# EAGLE design 4HP_Mixer (EAGLE 7.1.0)
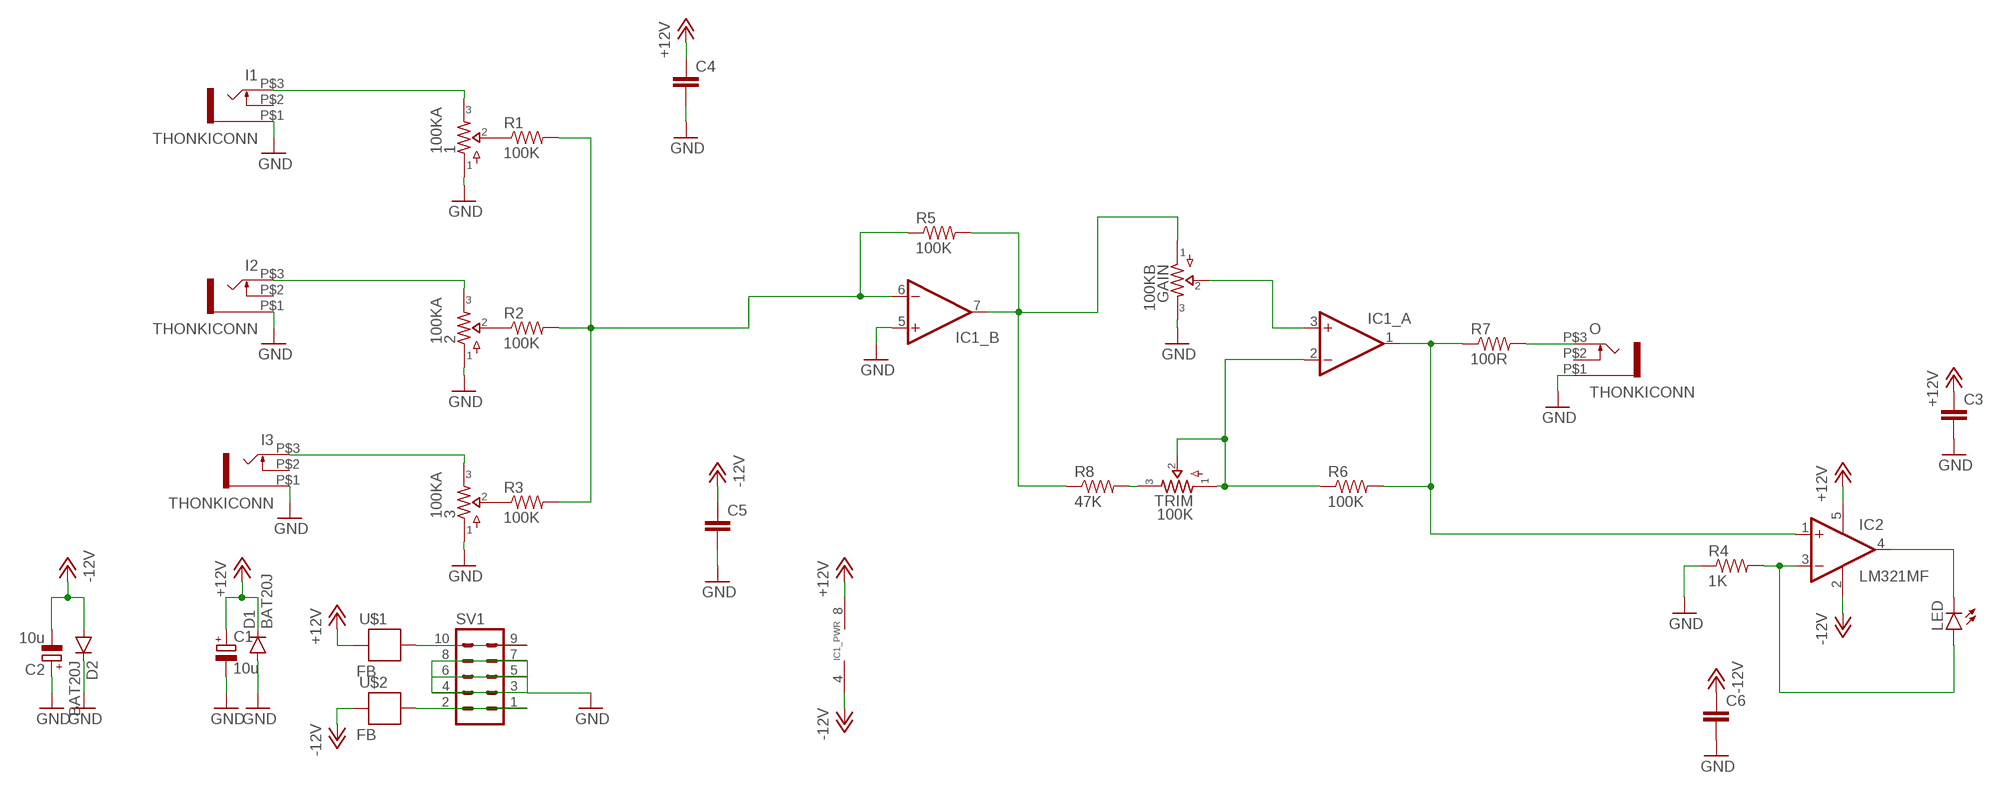
[diagram p0: schematic, sheet 1]

## Parts
1  100KA  POTS9MM_MOUNTED_2MMH  [9MM_W/MOUNTS-2MMHOLES]
2  100KA  POTS9MM_MOUNTED_2MMH  [9MM_W/MOUNTS-2MMHOLES]
3  100KA  POTS9MM_MOUNTED_2MMH  [9MM_W/MOUNTS-2MMHOLES]
C1  10u  CAPACITOR_POL-CASE_B  [CASE_B]
C2  10u  CAPACITOR_POL-CASE_B  [CASE_B]
C3  CAP0603-CAP  [0603-CAP]
C4  CAP0603-CAP  [0603-CAP]
C5  CAP0603-CAP  [0603-CAP]
C6  CAP0603-CAP  [0603-CAP]
D1  BAT20J  DIODESOD123  [SOD-123]
D2  BAT20J  DIODESOD123  [SOD-123]
GAIN  100KB  POTS9MM_MOUNTED_2MMH  [9MM_W/MOUNTS-2MMHOLES]
I1  THONKICONN  [THONKICONN]
I2  THONKICONN  [THONKICONN]
I3  THONKICONN  [THONKICONN]
IC1  DUALSMD  [SO08]
IC2  LM321MF  [SOT23-5]
LED  LED3MM  [LED3MM]
O  THONKICONN  [THONKICONN]
R1  100K  RESISTOR0603-RES  [0603-RES]
R2  100K  RESISTOR0603-RES  [0603-RES]
R3  100K  RESISTOR0603-RES  [0603-RES]
R4  1K  RESISTOR0603-RES  [0603-RES]
R5  100K  RESISTOR0603-RES  [0603-RES]
R6  100K  RESISTOR0603-RES  [0603-RES]
R7  100R  RESISTOR0603-RES  [0603-RES]
R8  47K  RESISTOR0603-RES  [0603-RES]
SV1  EURO_POWER_HEADER  [EURO_POWER_HEADER]
TRIM  100K  POTSSMALL_PADS  [PADS_SMALL]
U$1  FB  [0603]
U$2  FB  [0603]

## Nets
+12V: C1.+ C3.1 C4.1 D1.C IC1.8(_PWR:V+) IC2.5(V+) U$1.2
-12V: C2.- C5.1 C6.1 D2.A IC1.4(_PWR:V-) IC2.2(V-) U$2.2
GND: 1.P$1 2.P$1 3.P$1 C1.- C2.+ C3.2 C4.2 C5.2 C6.2 D1.A D2.C GAIN.P$3 I1.P$1 I2.P$1 I3.P$1 IC1.5(_B:+IN) O.P$1 R4.1 SV1.3 SV1.4 SV1.5 SV1.6 SV1.7 SV1.8
N$1: IC2.3(-IN) LED.A R4.2
N$2: IC2.4(OUT) LED.K(C)
N$3: IC1.2(_A:-IN) R6.1 TRIM.1 TRIM.2
N$4: IC1.1(_A:OUT) IC2.1(+IN) R6.2 R7.1
N$5: GAIN.P$1 IC1.7(_B:OUT) R5.2 R8.1
N$6: O.P$3 R7.2
N$7: 1.P$2 R1.1
N$8: 2.P$2 R2.1
N$9: 3.P$2 R3.1
N$10: IC1.6(_B:-IN) R1.2 R2.2 R3.2 R5.1
N$11: SV1.9 SV1.10 U$1.1
N$12: SV1.1 SV1.2 U$2.1
N$13: GAIN.P$2 IC1.3(_A:+IN)
N$14: R8.2 TRIM.3
N$17: 1.P$3 I1.P$3
N$18: 2.P$3 I2.P$3
N$19: 3.P$3 I3.P$3
Unconnected: I1.P$2 I2.P$2 I3.P$2 O.P$2

## Library data of the parts
1-3 GAIN TRIM = potentiometers:POTS
C1 C2 = dp_devices:CAPACITOR_POL: Polarized capacitor in various packages
C3-C6 = SparkFun-Passives:CAP: Capacitor Standard 0603 ceramic capacitor, and 0.1" leaded capacitor.
D1 D2 = SparkFun-DiscreteSemi:DIODE: Diode These are standard reverse protection diodes and small signal diodes. SMA package can handle up to about 1A. SOD-323 can handle about 200mA. What the SOD-323 package when ordering, there are some mfgs out there that are 5-pin packages.
I1-I3 O = MusicThingModular:THONKICONN
IC1 = integrated circuits:DUAL: OP AMP
IC2 = linear:LM321?*: Low Power Single Op Amp Source: http://cache.national.com/ds/LM/LM321.pdf
LED = SparkFun-LED:LED: LEDs Standard schematic elements and footprints for 5mm, 3mm, 1206, and 0603 sized LEDs. 5mm - Spark Fun Electronics SKU : COM-00529 (and others)
R1-R8 = SparkFun-Passives:RESISTOR: Resistor Basic schematic elements and footprints for 0603, 1206, and PTH resistors.
SV1 = MusicThingModular:EURO_POWER_HEADER: Power Header 10 pin power header for Eurorack Power Supplies
U$1 U$2 = SparkFun-Passives:FB

## Board
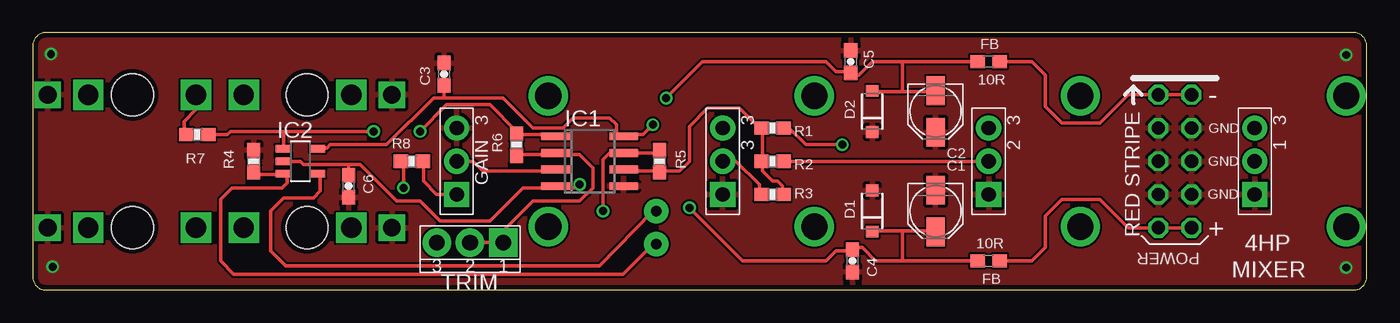
[diagram p1: board, top side]
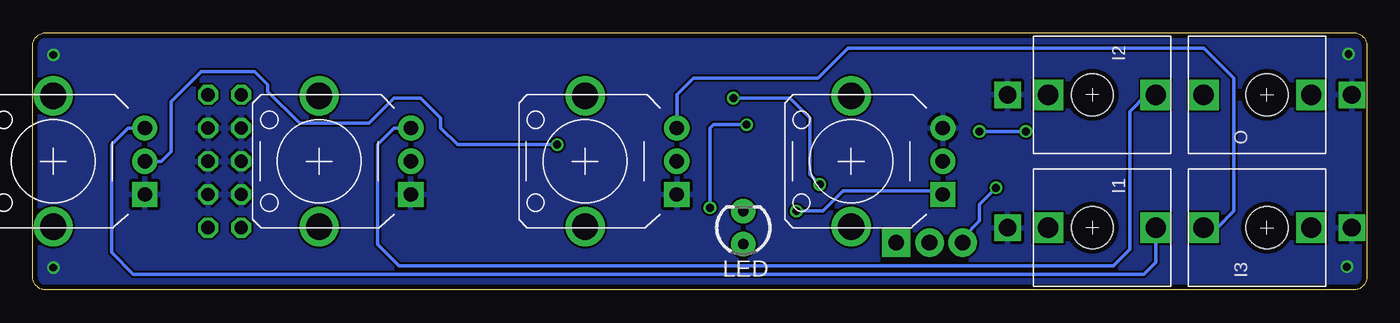
[diagram p2: board, bottom side, seen from below]

Size 101.91 x 19.68 mm. Coordinates in mm from the lower left corner, seen from the top.
Outline: 0,18.67 0,1 arc90 1,0 100.91,0 arc90 101.91,1 101.91,18.67 arc90 100.91,19.67 1,19.67 arc90 0,18.67
Copper layers (1*16): Top 0.0356mm / dielectric 1.5011mm / Bottom 0.0356mm
Design rules "LaenPCBOrder": minimum track width 6mil, minimum drill 13mil, track to track 6mil, track to pad 6mil, pad to pad 6mil, via to via 6mil, smd to smd 6mil, copper to edge 15mil, drill to drill 6mil, minimum pad ring 7mil, minimum via ring 7mil, stop-mask expansion 3mil, vias tented up to drill 0mil, thermal gap 10mil
Holes 3.2 mm at 7.62,14.92 20.95,14.92 20.95,4.76 7.62,4.76

### Footprints (pad centres in the part's own frame; a part is rotated, then mirrored left to right if it is on the bottom)
9MM_W/MOUNTS-2MMHOLES = drill 1.1 pad 1.93 square: P$1 2.54,0 | drill 1.1 pad 1.93: P$2 0,0; P$3 -2.54,0 | drill 2: P$4 -5,7; P$5 5,7
CASE_B = smd 2.2 x 1.4: + 1.6,0; - -1.6,0
0603-CAP = smd 1.1 x 1: 1 -0.85,0; 2 0.85,0
SOD-123 = smd 0.9 x 0.95: A 1.575,0; C -1.575,0
THONKICONN = drill 1.35 square: P$1 0,-6.48 | drill 1.55 square: P$2 0,-3.38; P$3 0,4.84
SO08 = smd 0.6 x 2.2: 1 -1.905,-2.6; 2 -0.635,-2.6; 3 0.635,-2.6; 4 1.905,-2.6; 5 1.905,2.6; 6 0.635,2.6; 7 -0.635,2.6; 8 -1.905,2.6
SOT23-5 = smd 0.6 x 1.2: 1 -0.95,-1.306; 2 0,-1.306; 3 0.95,-1.306; 4 0.95,1.306; 5 -0.95,1.306
LED3MM = drill 0.813 pad 1.88: A -1.27,0; K 1.27,0
0603-RES = smd 1.1 x 1: 1 -0.85,0; 2 0.85,0
EURO_POWER_HEADER = drill 1.016 octagon: 1 -5.08,-1.27; 2 -5.08,1.27; 3 -2.54,-1.27; 4 -2.54,1.27; 5 0,-1.27; 6 0,1.27; 7 2.54,-1.27; 8 2.54,1.27; 9 5.08,-1.27; 10 5.08,1.27
PADS_SMALL = drill 1.2 pad 2.184 square: 1 2.54,0 | drill 1.2 pad 2.184: 2 0,0; 3 -2.54,0
0603 = smd 1.1 x 1: 1 -0.85,0; 2 0.85,0

### Placement (x,y rotation side)
1  93.34,9.84 270 top
2  73.02,9.84 270 top
3  52.71,9.84 270 top
C1  68.96,6.03 270 top
C2  68.96,13.65 270 top
C3  31.43,16.51 90 top
C4  62.61,2.22 270 top
C5  62.48,17.46 90 top
C6  24.13,7.94 270 top
D1  64.13,6.03 90 top
D2  64.13,13.65 90 top
GAIN  32.39,9.84 270 top
I1  20.95,4.76 270 bottom
I2  20.95,14.92 270 bottom
I3  7.62,4.76 90 bottom
IC1  42.55,9.84 270 top
IC2  20.45,9.84 270 top
LED  47.62,4.76 90 bottom
O  7.62,14.92 90 bottom
R1  56.52,12.38 180 top
R2  56.52,9.84 180 top
R3  56.52,7.3 0 top
R4  16.89,9.84 270 top
R5  47.88,9.84 90 top
R6  36.96,11.11 90 top
R7  12.57,11.87 180 top
R8  28.96,9.84 180 top
SV1  87.25,9.84 270 top
TRIM  33.4,3.62 0 top
U$1  73.02,2.22 180 top
U$2  73.02,17.46 180 top

### Tracks (layer width: path | path; a pad name or v marks a point on that pad's centre or on a via)
+12V  (via drill 0.61)
  Top 0.254: 66.42,2.22 64.39,2.22 63.37,3.24 62.61,3.24 C4.1 62.61,2.98 61.34,2.98 60.58,2.22 54.23,2.22 v50.16,6.29 | 66.42,2.22 U$1.2 | 66.42,4.51 64.13,4.51 D1.C | 66.42,2.22 66.42,4.51 | 66.42,4.51 68.71,4.51 C1.+ | 31.43,14.67 35.94,14.67 38.23,12.38 40.51,12.38 41.27,13.14 44.07,13.14 44.58,12.64 44.58,11.87 44.83,11.62 45.09,11.62 IC1.8 45.34,11.87 46.61,11.87 v47.37,12.64 | 31.43,14.67 30.61,14.67 27.05,11.11 22.73,11.11 22.48,10.86 21.97,10.86 IC2.5 | C3.1 31.43,14.67
  Bottom 0.254: v50.16,6.29 50.16,12.38 49.91,12.64 v47.37,12.64
-12V  (via drill 0.61)
  Top 0.254: 66.42,17.46 64.13,17.46 63.12,16.45 62.48,16.45 C5.1 62.36,16.7 61.34,16.7 60.58,17.46 51.18,17.46 v48.39,14.67 | 66.42,17.46 U$2.2 72.26,17.46 | 66.42,15.18 64.64,15.18 D2.A | 66.42,15.18 66.42,17.46 | 66.42,15.18 68.71,15.18 C2.- | IC2.2 20.45,9.84 20.7,9.59 24.13,9.59 | 24.13,9.59 25.02,9.59 27.81,6.79 29.59,6.79 31.11,5.27 34.93,5.27 37.47,7.81 39.75,7.81 IC1.4 40.01,7.81 41.53,7.81 v41.78,8.06 | C6.1 24.13,9.59
  Bottom 0.254: v41.78,8.06 42.55,8.83 42.55,13.14 44.07,14.67 v48.39,14.67
GND  (via drill 0.6)
  other vias: 100.33,17.97 1.52,1.78 1.4,18.03 100.33,1.71
  pour Bottom: -5.71,25.08 114.93,25.08 114.93,-1.59 -5.71,-1.59
  pour Top: -10.79,22.54 111.12,22.54 111.12,-4.13 -10.79,-4.13
N$1
  Top 0.254: R4.2 16.89,8.83 18.92,8.83 IC2.3 19.18,8.83 19.43,8.83 19.43,8.19 19.05,7.81 15.24,7.81 14.35,6.92 14.35,2.22 15.37,1.21 45.09,1.21 47.37,3.49 LED.A
N$2
  Top 0.254: LED.K 47.37,6.03 43.31,1.84 19.3,1.84 18.16,2.98 18.16,6.03 19.18,7.05 21.46,7.05 21.97,7.56 21.97,8.83 IC2.4
N$3
  Top 0.254: TRIM.2 TRIM.1 35.94,4.51 38.23,6.79 41.78,6.79 42.8,7.81 42.8,9.33 41.78,10.35 40.01,10.35 IC1.2 39.75,10.35 36.96,10.35 R6.1
N$4  (via drill 0.61)
  Top 0.254: R7.1 14.86,11.87 15.11,12.13 19.18,12.13 | v26.04,12.13 19.18,12.13 | v29.59,12.13 31.62,14.16 34.93,14.16 36.96,12.13 R6.2 36.96,11.87 39.75,11.87 IC1.1 | 19.18,12.13 19.18,10.86 IC2.1
  Bottom 0.254: v29.59,12.13 v26.04,12.13
N$5  (via drill 0.61)
  Top 0.254: GAIN.P$1 30.86,7.3 29.84,8.32 29.84,9.84 R8.1 | v43.56,6.03 43.56,9.97 44.07,10.48 IC1.7 47.88,10.48 R5.2 47.88,10.73
  Bottom 0.254: v43.56,6.03 41.53,6.03 40.01,7.56 32.64,7.56 GAIN.P$1
N$6
  Top 0.254: O.P$3 12.45,14.92 12.45,13.78 11.56,12.89 11.56,11.87 R7.2
N$7  (via drill 0.6)
  Top 0.254: v61.85,11.11 59.05,11.11 57.79,12.38 R1.1
  Bottom 0.254: v61.85,11.11 69.47,11.11 70.74,12.38 70.74,13.14 72.26,14.67 74.3,14.67 76.2,12.76 81.53,12.76 83.95,15.18 83.95,15.68 84.96,16.7 89.03,16.7 91.31,14.41 91.31,10.6 92.07,9.84 1.P$2
N$8
  Top 0.254: 2.P$2 R2.1
N$9
  Top 0.254: 3.P$2 53.72,9.84 55.5,8.06 55.5,7.3 R3.1
N$10
  Top 0.254: 55.75,9.84 55.75,9.08 56.52,8.32 56.9,8.32 57.28,7.94 57.28,7.3 R3.2 | 55.75,9.84 55.75,12.38 R1.2 55.5,12.38 53.98,13.91 51.56,13.91 50.16,12.51 50.16,9.84 49.4,9.08 47.88,9.08 | 55.75,9.84 R2.2 | 47.88,9.08 45.34,9.08 IC1.6 | 47.88,9.08 R5.1
N$11
  Top 0.254: U$1.1 76.33,2.22 77.34,3.24 77.34,5.65 78.61,6.92 81.53,6.92 83.69,4.76 SV1.9 SV1.10
N$12
  Top 0.254: SV1.2 SV1.1 83.69,14.92 81.53,12.76 78.61,12.76 77.34,14.03 77.34,16.45 76.33,17.46 U$2.1
N$13
  Top 0.254: GAIN.P$2 33.66,9.84 34.42,9.08 39.75,9.08 IC1.3
N$14  (via drill 0.61)
  Top 0.254: v28.32,7.81 28.32,9.84 R8.2
  Bottom 0.254: v28.32,7.81 29.59,6.54 29.59,5.27 30.86,4 TRIM.3
N$17
  Bottom 0.254: 1.P$3 94.61,12.38 95.88,11.11 95.88,2.86 94.23,1.21 17.02,1.21 16.13,2.1 16.13,4.76 I1.P$3
N$18
  Bottom 0.254: 15.88,14.92 I2.P$3 16.83,14.92 18.1,13.65 18.1,3.11 19.37,1.84 73.91,1.84 75.56,3.49 75.56,11.11 74.3,12.38 2.P$3
N$19
  Bottom 0.254: 12.7,4.76 I3.P$3 11.43,4.76 10.16,6.03 10.16,16.19 12.45,18.48 39.62,18.48 41.91,16.19 51.44,16.19 52.71,14.92 3.P$3

### Text on the board
tPlace: FB | 10R | 10R | 4HP | FB | MIXER